# Altium schematic sheet USB.SchDoc
size A4; SheetNumber: 5; SheetTotal: 5
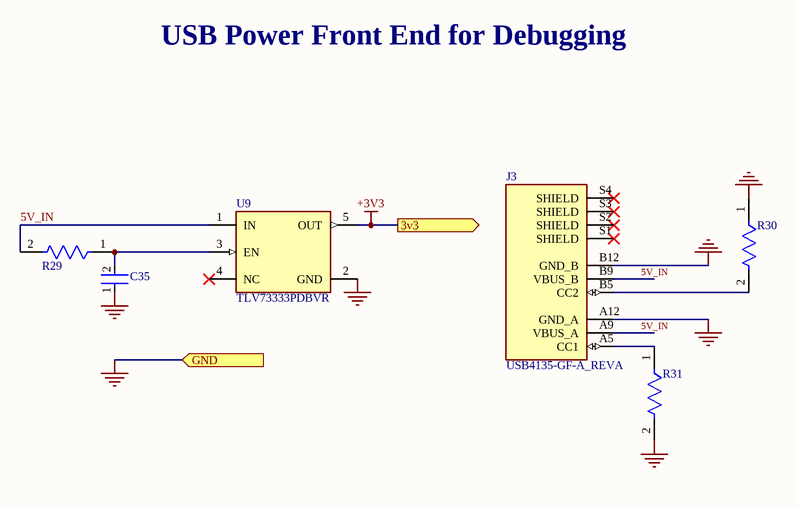
[diagram p0: USB.SchDoc]

## Parts
C35  C1608X5R1H105K080AB  [FP-C1608-080-0_1-IPC_B]  (value not drawn)
J3  USB4135-GF-A_REVA  [GCT_USB4135-GF-A_REVA]
R29  RC0603FR-0710KL  [FP-RC0603-0_55-IPC_C]  (value not drawn)
R30  CRCW06035K10FKEA  [FP-CRCW0603-e3-IPC_C]  (value not drawn)
R31  CRCW06035K10FKEA  [FP-CRCW0603-e3-IPC_C]  (value not drawn)
U9  TLV73333PDBVR  [FP-DBV0005A-MFG]

## Ports
3v3 (out), GND (in)

## Nets
+3V3: U9.5(OUT) ; port 3v3
GND: C35.1 J3.A12(GND_A) J3.B12(GND_B) R30.1 R31.2 U9.2(GND) ; port GND
5V_IN: J3.A9(VBUS_A) J3.B9(VBUS_B) R29.2 U9.1(IN)
NetC35_2: C35.2 R29.1 U9.3(EN)
NetJ3_A5: J3.A5(CC1) R31.1
NetJ3_B5: J3.B5(CC2) R30.2

Not connected (* = marked no-connect by the designer): J3 S1(SHIELD)* S2(SHIELD)* S3(SHIELD)* S4(SHIELD)*; U9 4(NC)*

## Notes on the sheet
- USB Power Front End for Debugging

## Library data of the parts
C35 = CMP-2000-06025-2: Multilayer Ceramic Capacitors 1μF ±10% 50V X5R SMD 0603; Capacitance: 1uF; Lead Free: Lead Free; Height: 0.8mm; Mount: Surface Mount; Radiation Hardening: No; Thickness: 0.035inch; Length: 1.6mm; Max Operating Temperature: 85°C; REACH SVHC: No SVHC; Min Operating Temperature: -55°C; Construction: Flat; RoHS Compliant: Yes; Voltage Rating: 50V; Dielectric: X5R; Packaging: Tape and Reel; Termination: SMD/SMT; Voltage Rating (DC): 50V; Case Code (Imperial): 0603; Voltage: 50V; Width: 0.031inch; Weight: 7.1E-05oz; Depth: 0.8mm; Case Code (Metric): 1608; Series: C; Case/Package: 0603; Tolerance: 10%; Resistor Type: Ceramic; Number of Pins: 2; Dielectric Material: Ceramic; Package Quantity: 1
J3 = USB4135-GF-A_REVA: USB CONN, TYPE C, R/A RCPT, 6POS, SMT; USB Connector Type:USB Type C; USB Standard:-; Gender:Receptacle; No. of Positions:6Positions; Connector Mounting:Surface Mount; Orientation:Right Angle; Contact 26AK7776; MF: Global Connector Technology; MP: USB4135GFA; SnapEDA_Link: https://www.snapeda.com/parts/USB4135GFA/Global+Connector+Technology/view-part/?ref=snap; Package: None; Value: *; Check_prices: https://www.snapeda.com/parts/USB4135GFA/Global+Connector+Technology/view-part/?ref=eda
R29 = CMP-2100-03664-2: RES 10K OHM 1% 1/10W 0603; Voltage Rating: 75V; Voltage Rating (DC): 50V; Resistance: 10kR; Power Rating: 100mW; Temperature Coefficient: 100ppm/°C; Depth: 0.8mm; Termination: SMD/SMT; Resistor Type: Thick Film; Series: RC; Construction: Rectangular; Features: Moisture Resistant; Packaging: Tape and Reel; Min Operating Temperature: -55°C; Number of Terminations: 2; Lead Pitch: 0.3mm; RoHS Compliant: Yes; Case/Package: 0603; Resistance Tolerance: 1%; Military Standard: Not; Weight: 7.1E-05oz; Number of Pins: 2; Tolerance: 1%; Length: 1.6mm; Case Code (Imperial): 0603; Lead Free: Lead Free; Width: 0.8mm; Max Power Dissipation: 100mW; Height: 0.45mm; Max Operating Temperature: 155°C; Case Code (Metric): 1608; Size Code: 0603
R30 R31 = CMP-1012-00590-3: RES Thick Film, 5.1kΩ, 1%, 0.1W, 100ppm/°C, 0603; Power Rating: 100mW; Voltage Rating (DC): 75V; Resistance: 5.1kR; Width: 0.85mm; Depth: 0.85mm; Military Standard: Not; Package Quantity: 5000; Case Code (Metric): 1608; Length: 1.55mm; Weight: 7.1E-05oz; Packaging: Tape and Reel; Temperature Coefficient: 100ppm/°C; Case Code (Imperial): 0603; Lead Free: Lead Free; Radiation Hardening: No; Contact Plating: Tin; Composition: Thick Film; Max Operating Temperature: 155°C; Termination: SMD/SMT; Case/Package: 0603; Min Operating Temperature: -55°C; Tolerance: 1%; Voltage Rating: 75V; Mount: Surface Mount; Height: 0.45mm
U9 = CMP-04917-000053-1: IC REG LINEAR 3.3V 300MA SOT23-5; Manufacturer: Texas Instruments; Max Junction Temp: +125°C; Accuracy Percentage: 1%; Min Supply Voltage: 1.4V; Number Of Outputs: 1; Dropout Voltage: 125mV; Nominal Supply Current: 34uA; Max Supply Voltage: 5.5V; Output Type: Fixed; Standoff Height: 0mm; Digikey Description: IC REG LINEAR 3.3V 300MA SOT23-5; Manufacturer Part Number: TLV73333PDBVR; Temperature Range High: +125°C; Temperature: -40°C to +125°C; Output Current: 300mA; Mouser Description: LDO Voltage Regulators Capacitr-Free 300-mA 5-SOT-23 -40 to 125; Automotive: No; Height: 1.45mm; Device Class L3: Voltage Regulators - Linear; ComponentLink2Description: Datasheet; Device Class L1: Integrated Circuits (ICs); ComponentLink2URL: http://www.ti.com/lit/ds/symlink/tlv733p.pdf; Octopart: https://octopart.com/tlv73333pdbvr-texas+instruments-51080890; Temperature Range Low: -40°C; RoHS: TRUE; Lead Free: Yes; Output Voltage: 3.3V; Package: DBV0005A; Device Class L2: Power Management ICs; Category: IC